# Altium schematic sheet power.SchDoc: Balise Vision - Power
size A3; Author: B Labbe; CompanyName: Oufffteam; DrawnBy: B Labbe; Engineer: B Labbe; Organization: Oufffteam; Address1: L3, 12a Rodborough Rd; Address2: Frenchs Forest; Address3: NSW; Address4: Australia 2086; Revision: A; SheetNumber: 2; SheetTotal: 10; DocumentName: Balise Vision - Power
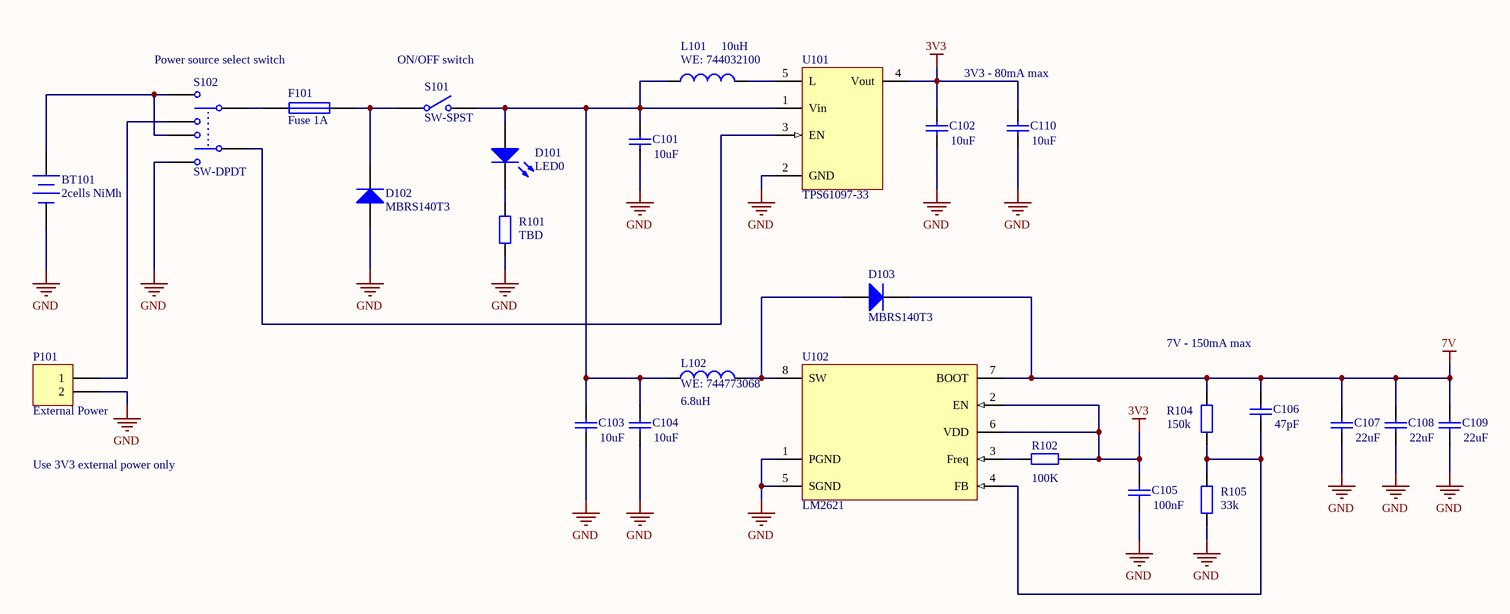
[diagram p0: power.SchDoc]

## Parts
BT101  2cells NiMh  [BAT-2]
C101  value 10uF  [2012[0805]]  (hidden comment: 10uF 10V X5R 0805)
C102  value 10uF  [2012[0805]]  (hidden comment: 10uF 10V X5R 0805)
C103  value 10uF  [2012[0805]]  (hidden comment: 10uF 10V X5R 0805)
C104  value 10uF  [2012[0805]]  (hidden comment: 10uF 10V X5R 0805)
C105  value 100nF  [1608[0603]]  (hidden comment: 100nF 10V X7R 0603)
C106  value 47pF  [1608[0603]]  (hidden comment: 47pF 50V COG 0603)
C107  value 22uF  [3225[1210]]  (hidden comment: 22uF 16V X7R 1210)
C108  value 22uF  [3225[1210]]  (hidden comment: 22uF 16V X7R 1210)
C109  value 22uF  [3225[1210]]  (hidden comment: 22uF 16V X7R 1210)
C110  value 10uF  [2012[0805]]  (hidden comment: 10uF 10V X5R 0805)
D101  LED0  [LED-0]
D102  MBRS140T3  [SMB]
D103  MBRS140T3  [SMB]
F101  Fuse 1A  [PIN-W2/E2.8]
L101  WE: 744032100  value 10uH  [0402-A]
L102  WE: 744773068  value 6.8uH  [0402-A]
P101  External Power  [HDR1X2]
R101  value TBD  [1608[0603]]  (hidden comment: Res 0603 TBD)
R102  value 100K  [1608[0603]]  (hidden comment: 100k 0603)
R104  value 150k  [1608[0603]]  (hidden comment: 150k 0603)
R105  value 33k  [1608[0603]]  (hidden comment: 33k 0603)
S101  SW-SPST  [SPST-2]
S102  SW-DPDT  [DPDT-6]
U101  TPS61097-33  [DBV005]
U102  LM2621  [MUA08A]

## Nets
3V3: C102.2 C105.2 C110.2 R102.2 U101.4(Vout) U102.2(EN) U102.6(VDD)
7V: C106.2 C107.2 C108.2 C109.2 D103.2(K) R104.2 U102.7(BOOT)
GND: BT101.2(-) C101.1 C102.1 C103.1 C104.1 C105.1 C107.1 C108.1 C109.1 C110.1 D102.1(A) P101.2 R101.1 R105.1 S102.6 U101.2(GND) U102.1(PGND) U102.5(SGND)
NetBT101_1: BT101.1(+) S102.2 S102.5
NetC101_2: C101.2 C103.2 C104.2 D101.1(A) L101.1 L102.1 S101.2(NO) U101.1(Vin)
NetC106_1: C106.1 R104.1 R105.2 U102.4(FB)
NetD101_2: D101.2(K) R101.2
NetD102_2: D102.2(K) F101.2 S101.1(COMMON)
NetD103_1: D103.1(A) L102.2 U102.8(SW)
NetF101_1: F101.1 S102.1
NetL101_2: L101.2 U101.5(L)
NetP101_1: P101.1 S102.3
NetR102_1: R102.1 U102.3(Freq)
NetS102_4: S102.4 U101.3(EN)

## Notes on the sheet
- Power source select switch
- (near S101) ON/OFF switch
- 3V3 - 80mA max
- 7V - 150mA max
- Use 3V3 external power only
- Title
- Size:
- Date:
- A3
- Number:
- Time:
- Revision:
- Sheet
- of
- Oufffteam
- 3 place Carnot
- 26100
- Romans sur Isère
- oufffteam@gmail.com
- File:

## Library data of the parts
BT101 = Battery: Multicell Battery; Published: 24-Mar-1999; LatestRevisionDate: 17-Jul-2002; LatestRevisionNote: Re-released for DXP Platform.; PackageReference: BAT-2; Publisher: Altium Limited
C101-C110 = Cap: Capacitor; Published: 8-Jun-2000; LatestRevisionDate: 17-Jul-2002; LatestRevisionNote: Re-released for DXP Platform.; PackageReference: RAD-0.3; Publisher: Altium Limited
D101 = LED0: Typical INFRARED GaAs LED; Published: 8-Jun-2000; LatestRevisionDate: 08-Jul-2005; LatestRevisionNote: Mech Layer 1 removed.; PackageReference: LED-0; Publisher: Altium Limited
D102 D103 = Diode: Default Diode; Published: 8-Jun-2000; LatestRevisionDate: 17-Jul-2002; LatestRevisionNote: Re-released for DXP Platform.; PackageDocument: Sep-1996; PackageReference: SMC; Publisher: Altium Limited; Code_JEDEC: DO-214-AB
F101 = Fuse 1: Fuse; Published: 8-Jun-2000; LatestRevisionDate: 17-Jul-2002; LatestRevisionNote: Re-released for DXP Platform.; PackageReference: PIN-W2/E2.8; Publisher: Altium Limited
L101 L102 = Inductor: Code_IEC: 1005; Published: 8-Jun-2000; LatestRevisionDate: 17-Jul-2002; LatestRevisionNote: Re-released for DXP Platform.; PackageReference: 0402-A; Publisher: Altium Limited; Code_JEITA: 0402
P101 = Header 2: Header, 2-Pin; LatestRevisionDate: 17-Jul-2002; LatestRevisionNote: Re-released for DXP Platform.; Publisher: Altium Limited
R101 R102 R104 R105 = Res2: Resistor; Published: 8-Jun-2000; LatestRevisionDate: 17-Jul-2002; LatestRevisionNote: Re-released for DXP Platform.; PackageReference: AXIAL-0.4; Publisher: Altium Limited
S101 = SW-SPST: Single-Pole, Single-Throw Switch; Published: 24-Mar-1999; LatestRevisionDate: 17-Jul-2002; LatestRevisionNote: Re-released for DXP Platform.; PackageReference: SPST-2; Publisher: Altium Limited
S102 = SW-DPDT: Double-Pole, Double-Throw Switch; Published: 24-Mar-1999; LatestRevisionDate: 17-Jul-2002; LatestRevisionNote: Re-released for DXP Platform.; PackageReference: DPDT-6; Publisher: Altium Limited
U101 = TPS61097: LOW INPUT VOLTAGE SYNCHRONOUS BOOST CONVERTER  WITH LOW QUIESCENT CURRENT
U102 = LM2621: Low Input Voltage, Step-Up DC-DC Converter